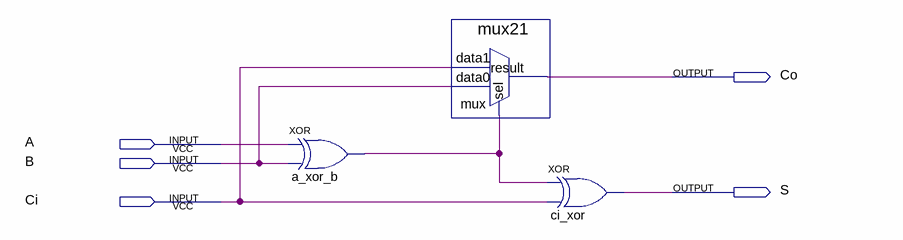
[diagram p0: schematic sheet]
// Quartus schematic adder.bdf as structural Verilog: 3 symbols, 5 pins
module adder (
  input  A,
  input  B,
  input  Ci,
  output Co,
  output S
);

  wire a_xor_b_out;

  xor a_xor_b (a_xor_b_out, A, B);
  mux21 mux (.data1(Ci), .data0(B), .sel(a_xor_b_out), .result(Co));
  xor ci_xor (S, a_xor_b_out, Ci);
endmodule
